# EAGLE design mini-MIDI-hub (EAGLE 6.6.0)
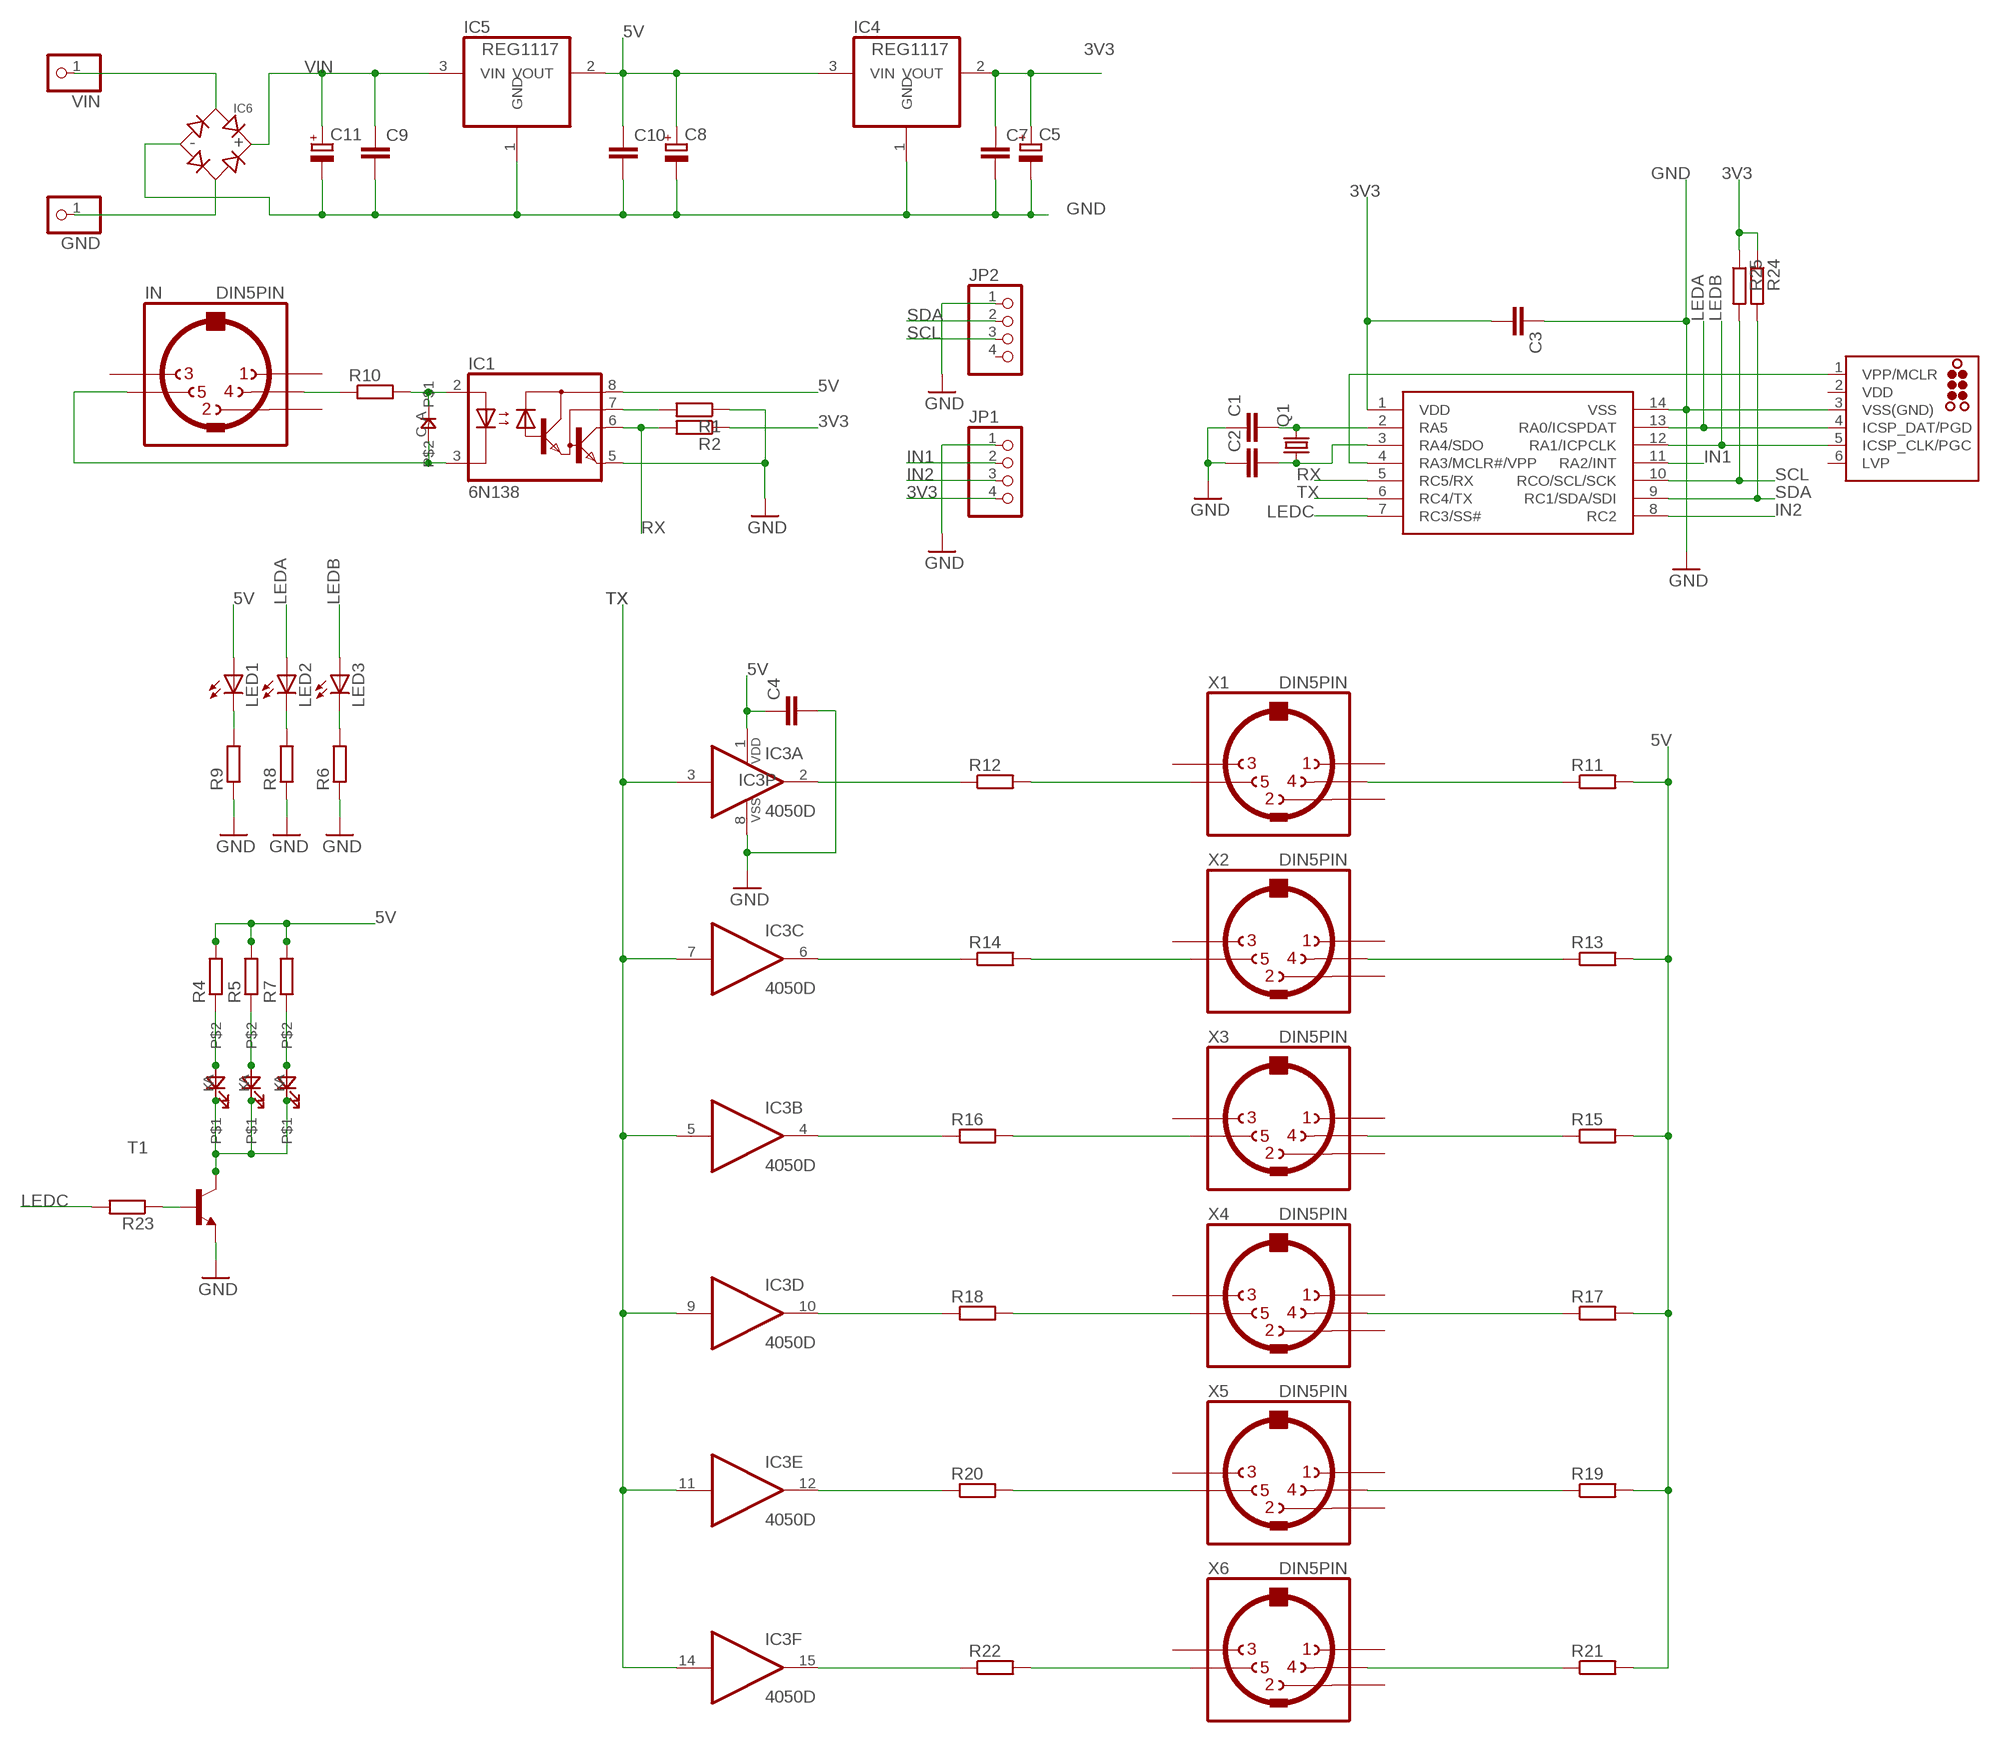
[diagram p0: schematic, sheet 1]

## Parts
C1  C-EUC0805  [C0805]
C2  C-EUC0805  [C0805]
C3  C-EUC0805  [C0805]
C4  C-EUC0805  [C0805]
C5  CPOL-EUE2-4  [E2-4]
C7  C-EUC0805  [C0805]
C8  CPOL-EUE2-4  [E2-4]
C9  C-EUC0805  [C0805]
C10  C-EUC0805  [C0805]
C11  CPOL-EUE2-4  [E2-4]
D1  0805DIODE  [0805DIODE]
GND  PINHD-1X1  [1X01]
IC1  6N138  [DIL08]
IC2  PIC16F1825SO14  [SO14]
IC3  4050D  [SO16]
IC4  REG1117  [SOT223]
IC5  REG1117  [SOT223]
IC6  BRIDGERECTIFIER  [SOIC-4]
ICSP  TC2030-MCP-NL  [TC2030-MCP-NL]
IN  DIN5PIN  [EDGEDIN]
JP1  PINHD-1X4  [1X04]
JP2  PINHD-1X4  [1X04]
LED1  LED3MM  [LED3MM]
LED2  LED3MM  [LED3MM]
LED3  LED3MM  [LED3MM]
Q1  CRYSTALHC49S  [HC49/S]
R1  R-EU_R0805  [R0805]
R2  R-EU_R0805  [R0805]
R4  R-EU_R0805  [R0805]
R5  R-EU_R0805  [R0805]
R6  R-EU_R0805  [R0805]
R7  R-EU_R0805  [R0805]
R8  R-EU_R0805  [R0805]
R9  R-EU_R0805  [R0805]
R10  R-EU_R0805  [R0805]
R11  R-EU_R0805  [R0805]
R12  R-EU_R0805  [R0805]
R13  R-EU_R0805  [R0805]
R14  R-EU_R0805  [R0805]
R15  R-EU_R0805  [R0805]
R16  R-EU_R0805  [R0805]
R17  R-EU_R0805  [R0805]
R18  R-EU_R0805  [R0805]
R19  R-EU_R0805  [R0805]
R20  R-EU_R0805  [R0805]
R21  R-EU_R0805  [R0805]
R22  R-EU_R0805  [R0805]
R23  R-EU_R0805  [R0805]
R24  R-EU_R0805  [R0805]
R25  R-EU_R0805  [R0805]
T1  MMBT3904LT1-NPN-SOT23-BEC  [SOT23-BEC]
U$2  LED5MM_EDGE  [LED5MM_EDGE]
U$3  LED5MM_EDGE  [LED5MM_EDGE]
U$4  LED5MM_EDGE  [LED5MM_EDGE]
VIN  PINHD-1X1  [1X01]
X1  DIN5PIN  [EDGEDIN]
X2  DIN5PIN  [EDGEDIN]
X3  DIN5PIN  [EDGEDIN]
X4  DIN5PIN  [EDGEDIN]
X5  DIN5PIN  [EDGEDIN]
X6  DIN5PIN  [EDGEDIN]

## Nets
3V3: C3.2 C5.+ C7.1 IC2.1(VDD) IC4.2(VOUT) JP1.4 R2.1 R24.1 R25.1
5V: C4.1 C8.+ C10.1 IC1.8(VCC) IC3.1(P:VDD) IC4.3(VIN) IC5.2(VOUT) LED1.A R4.2 R5.2 R7.2 R11.2 R13.2 R15.2 R17.2 R19.2 R21.2
GND: C1.1 C2.1 C3.1 C4.2 C5.- C7.2 C8.- C9.2 C10.2 C11.- IC1.5(GND) IC2.14(VSS) IC3.8(P:VSS) IC4.1(GND) IC5.1(GND) IC6.- ICSP.3(VSS(GND)) JP1.1 JP2.1 R1.1 R6.1 R8.1 R9.1 T1.E
IN1: IC2.11(RA2/INT) JP1.2
IN2: IC2.8(RC2) JP1.3
LEDA: IC2.13(RA0/ICSPDAT) ICSP.4(ICSP_DAT/PGD) LED2.A
LEDB: IC2.12(RA1/ICPCLK) ICSP.5(ICSP_CLK/PGC) LED3.A
LEDC: IC2.7(RC3/SS#) R23.2
N$1: R12.2 X1.5
N$2: R14.2 X2.5
N$3: R16.2 X3.5
N$4: R18.2 X4.5
N$5: R20.2 X5.5
N$6: R22.2 X6.5
N$7: IC3.15(F:O) R22.1
N$8: IC3.4(B:O) R16.1
N$9: IC3.12(E:O) R20.1
N$10: IC3.10(D:O) R18.1
N$11: IC3.6(C:O) R14.1
N$12: IC3.2(A:O) R12.1
N$13: LED2.K(C) R8.2
N$14: R11.1 X1.4
N$15: R13.1 X2.4
N$16: R15.1 X3.4
N$17: R17.1 X4.4
N$18: R19.1 X5.4
N$19: R21.1 X6.4
N$20: IN.4 R10.1
N$21: D1.A IC1.2(A) R10.2
N$22: IC1.7(VB) R1.2
N$23: LED1.K(C) R9.2
N$24: D1.C IC1.3(C) IN.5
N$25: LED3.K(C) R6.2
N$26: R4.1 U$2.A
N$27: IC6.~1(AC1) VIN.1
N$28: GND.1 IC6.~2(AC2)
N$29: C1.2 IC2.2(RA5) Q1.2
N$30: C2.2 IC2.3(RA4/SDO) Q1.1
N$31: R5.1 U$3.A
N$32: R7.1 U$4.A
N$34: T1.C U$2.K U$3.K U$4.K
N$36: IC2.4(RA3/MCLR#/VPP) ICSP.1(VPP/MCLR)
N$39: R23.1 T1.B
RX: IC1.6(VO) IC2.5(RC5/RX) R2.2
SCL: IC2.10(RCO/SCL/SCK) JP2.3 R25.2
SDA: IC2.9(RC1/SDA/SDI) JP2.2 R24.2
TX: IC2.6(RC4/TX) IC3.3(A:I) IC3.5(B:I) IC3.7(C:I) IC3.9(D:I) IC3.11(E:I) IC3.14(F:I)
VIN: C9.1 C11.+ IC5.3(VIN) IC6.+
Unconnected: ICSP.6(LVP) IN.1 IN.2 IN.3 JP2.4 X1.1 X1.2 X1.3 X2.1 X2.2 X2.3 X3.1 X3.2 X3.3 X4.1 X4.2 X4.3 X5.1 X5.2 X5.3 X6.1 X6.2 X6.3

## Power pins joined to a net without a drawn wire
VDD: ICSP.2(VDD)

## Library data of the parts
C1-C4 C7 C9 C10 = rcl:C-EU: CAPACITOR, European symbol
C5 C8 C11 = rcl:CPOL-EU: POLARIZED CAPACITOR, European symbol
D1 = jasons_stuff:0805DIODE
GND VIN = pinhead:PINHD-1X1: PIN HEADER
IC1 = optocoupler:6N138: MOTOROLA OPTO COUPLER; MF: VISHAY/TELEFUNKEN; MPN: 6N138; OC_FARNELL: 9860150; OC_NEWARK: 35K5294
IC2 = jasons_stuff:PIC16F1825
IC3 = 40xx:4050: Hex non-inverting BUFFER
IC4 IC5 = burr-brown:REG1117: 800mA and 1A Low Dropout (LDO) Positive Regulator 1.8V, 2.5V, 2.85V, 3.3V, 5V, and Adj; MPN: REG1117; OC_FARNELL: 1097566; OC_NEWARK: 14P6981
IC6 = microbuilder:BRIDGERECTIFIER: Bridge Rectifier SOIC-4: Comchip B4S-G - 400V 800mA, Peak Vf 1.1V (Digikey: 641-1334-1-ND)
ICSP = tag-connect:TC2030: TAG-CONNECT ICSP Connector Manufacturer: Tag-Connect <http://www.tag-connect.com> Cable for easy In-Circuit Serial Programming. Designed for Microchip ICD2, suitable for many others. Two variants - one "with legs" (for hands-free fit on PCB) and another "without legs" for quick programming. PAD Description 1 MCLR/Vpp 2 Vdd 3 GND 4 PGD (ISPDAT) 5 PGC (ISPCLK) 6 nc (used for LVP) ©2009 ROFA.cz - modified and updated by Robert Darlington ‹rdarlington@gmail.com›
IN X1-X6 = jason_eagle6:DIN5PIN: Female CONNECTOR 5 pins 90 deg. with shield, horizontal (DIN 41524)
JP1 JP2 = pinhead:PINHD-1X4: PIN HEADER
LED1-LED3 = led:LED: LED OSRAM: - CHIPLED LG R971, LG N971, LY N971, LG Q971, LY Q971, LO R971, LY R971 LH N974, LH R974 LS Q976, LO Q976, LY Q976 LO Q996 - Hyper CHIPLED LW Q18S LB Q993, LB Q99A, LB R99A - SideLED LS A670, LO A670, LY A670, LG A670, LP A670 LB A673, LV A673, LT A673, LW A673 LH A674 LY A675 LS A676, LA A676, LO A676, LY A676, LW A676 LS A679, LY A679, LG A679 - Hyper Micro SIDELED® LS Y876, LA Y876, LO Y876, LY Y876 LT Y87S - SmartLED LW L88C, LW L88S LB L89C, LB L89S, LG L890 LS L89K, LO L89K, LY L89K LS L896, LA L896, LO L896, LY L896 - TOPLED LS T670, LO T670, LY T670, LG T670, LP T670 LSG T670, LSP T670, LSY T670, LOP T670, LYG T670 LG T671, LOG T671, LSG T671 LB T673, LV T673, LT T673, LW T673 LH T674 LS T676, LA T676, LO T676, LY T676, LB T676, LH T676, LSB T676, LW T676 LB T67C, LV T67C, LT T67C, LS T67K, LO T67K, LY T67K, LW E67C LS E67B, LA E67B, LO E67B, LY E67B, LB E67C, LV E67C, LT E67C LW T67C LS T679, LY T679, LG T679 LS T770, LO T770, LY T770, LG T770, LP T770 LB T773, LV T773, LT T773, LW T773 LH T774 LS E675, LA E675, LY E675, LS T675 LS T776, LA T776, LO T776, LY T776, LB T776 LHGB T686 LT T68C, LB T68C - Hyper Mini TOPLED® LB M676 - Mini TOPLED Santana® LG M470 LS M47K, LO M47K, LY M47K Source: http://www.osram.convergy.de LUXEON: - LUMILED® LXK2-PW12-R00, LXK2-PW12-S00, LXK2-PW14-U00, LXK2-PW14-V00 LXK2-PM12-R00, LXK2-PM12-S00, LXK2-PM14-U00 LXK2-PE12-Q00, LXK2-PE12-R00, LXK2-PE12-S00, LXK2-PE14-T00, LXK2-PE14-U00 LXK2-PB12-K00, LXK2-PB12-L00, LXK2-PB12-M00, LXK2-PB14-N00, LXK2-PB14-P00, LXK2-PB14-Q00 LXK2-PR12-L00, LXK2-PR12-M00, LXK2-PR14-Q00, LXK2-PR14-R00 LXK2-PD12-Q00, LXK2-PD12-R00, LXK2-PD12-S00 LXK2-PH12-R00, LXK2-PH12-S00 LXK2-PL12-P00, LXK2-PL12-Q00, LXK2-PL12-R00 Source: www.luxeon.com KINGBRIGHT: KA-3528ASYC Source: www.kingbright.com
Q1 = crystal:CRYSTAL: CRYSTAL; OC_FARNELL: 1667008; OC_NEWARK: unknown
R1 R2 R4-R25 = rcl:R-EU_: RESISTOR, European symbol
T1 = transistor:*-NPN-: NPN Transistror BF959 corrected 2008.03.06
U$2-U$4 = jason_eagle6:LED5MM_EDGE

## Board
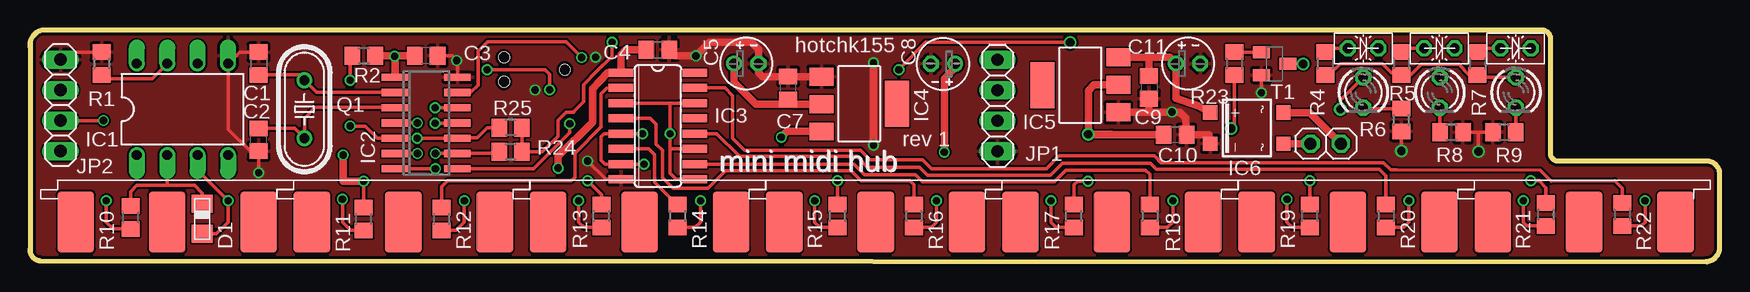
[diagram p1: board, top side]
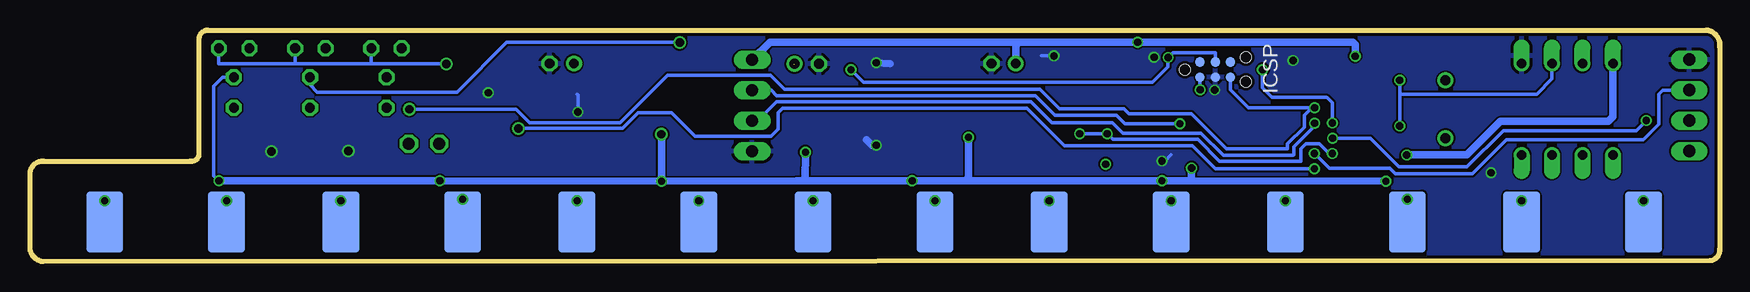
[diagram p2: board, bottom side, seen from below]

Size 140.85 x 19.3 mm. Coordinates in mm from the lower left corner, seen from the top.
Outline: 139.71,8.38 127.52,8.38 arc-90 126.75,8.89 126.75,18.54 arc90 126.02,19.3 1.1,19.3 arc90 0.01,17.91 0.01,1.07 arc90 0.8,0.08 139.71,0 arc90 140.85,1.27 140.85,7.37 arc90 139.71,8.38
Copper layers (1*16): Top 0.035mm / dielectric 1.5mm / Bottom 0.035mm
Design rules "ITEADstudio_DRC": minimum track width 6mil, minimum drill 12mil, track to track 6mil, track to pad 6mil, pad to pad 6mil, via to via 6mil, smd to smd 0mil, copper to edge 10mil, drill to drill 10mil, minimum pad ring 10mil, minimum via ring 6mil, stop-mask expansion 2mil, vias tented up to drill 100mil, thermal gap 10mil

### Footprints (pad centres in the part's own frame; a part is rotated, then mirrored left to right if it is on the bottom)
C0805 = smd 1.3 x 1.5: 1 -0.95,0; 2 0.95,0
E2-4 = drill 0.813 pad 1.27: + -1.016,0 | drill 0.813 pad 1.27 octagon: - 1.016,0
0805DIODE = smd 1.524 x 1.778: A -1.262,-0.005; C 1.238,-0.005
1X01 = drill 1.016 octagon: 1 0,0
DIL08 = drill 0.813 offset: 1 -3.81,-3.81; 2 -1.27,-3.81; 3 1.27,-3.81; 4 3.81,-3.81; 5 3.81,3.81; 6 1.27,3.81; 7 -1.27,3.81; 8 -3.81,3.81
SO14 = smd 0.6 x 2.2: 1 -3.81,-2.6; 2 -2.54,-2.6; 3 -1.27,-2.6; 4 0,-2.6; 5 1.27,-2.6; 6 2.54,-2.6; 7 3.81,-2.6; 8 3.81,2.6; 9 2.54,2.6; 10 1.27,2.6; 11 0,2.6; 12 -1.27,2.6; 13 -2.54,2.6; 14 -3.81,2.6
SO16 = smd 0.66 x 2.032: 1 -4.445,-3.073; 2 -3.175,-3.073; 3 -1.905,-3.073; 4 -0.635,-3.073; 5 0.635,-3.073; 6 1.905,-3.073; 7 3.175,-3.073; 8 4.445,-3.073; 9 4.445,3.073; 10 3.175,3.073; 11 1.905,3.073; 12 0.635,3.073; 13 -0.635,3.073; 14 -1.905,3.073; 15 -3.175,3.073; 16 -4.445,3.073
SOT223 = smd 1.499 x 2.007: 1 -2.261,-3.15; 2 0.025,-3.15; 3 2.311,-3.15 | smd 3.81 x 2.007: 4 0,3.15
SOIC-4 = smd 1.2 x 1.2: + 1.3,3.05; - -1.3,3.05; ~1 -1.3,-3.05; ~2 1.3,-3.05
TC2030-MCP-NL = smd 0.787 x 0.787: 1 1.27,-0.635; 2 1.27,0.635; 3 2.54,-0.635; 4 2.54,0.635; 5 3.81,-0.635; 6 3.81,0.635 | hole 0.889: 0,0; 5.08,-1.016; 5.08,1.016
EDGEDIN = smd 3.048 x 5.08: 1 -7.62,-10.16; 2 0,-10.16; 3 7.62,-10.16 | smd 3.048 x 5.08 bottom: 4 -5.08,-10.16; 5 5.08,-10.16
1X04 = drill 1.016 long: 1 -3.81,0; 2 -1.27,0; 3 1.27,0; 4 3.81,0
LED3MM = drill 0.813 octagon: A -1.27,0; K 1.27,0
HC49/S = drill 0.813: 1 -2.413,0; 2 2.413,0
R0805 = smd 1.3 x 1.5: 1 -0.95,0; 2 0.95,0
SOT23-BEC = smd 1 x 1.4: B -0.95,-1.1; C 0,1.1; E 0.95,-1.1
LED5MM_EDGE = drill 0.813 octagon: A -1.27,0; K 1.27,0

### Placement (x,y rotation side)
C1  19.06,16.51 270 top
C2  19.06,10.16 90 top
C3  33.03,17.14 180 top
C4  52.33,17.65 0 top
C5  59.7,16.51 0 top
C7  63.2,14.48 90 top
C8  76.11,16.48 180 top
C9  93.28,14.53 270 top
C10  95.46,10.59 0 top
C11  96.53,16.51 0 top
D1  14.36,3.56 270 top
GND  109.28,9.83 0 top
IC1  12.71,12.7 0 top
IC2  33.03,11.56 270 top
IC3  52.33,11.3 270 top
IC4  69.12,13.16 270 top
IC5  87.56,14.71 90 top
IC6  101.43,11.13 90 top
ICSP  44.59,16 0 bottom
IN  11.44,13.46 0 top
JP1  80.65,13 90 top
JP2  2.55,13.03 270 top
LED1  123.86,14.1 270 top
LED2  117.51,14.1 270 top
LED3  111.13,14.1 270 top
Q1  22.87,12.7 90 top
R1  5.98,16.51 270 top
R2  27.82,17.14 180 top
R4  107.96,16.51 270 top
R5  114.31,16.51 270 top
R6  114.31,11.81 90 top
R7  120.66,16.51 270 top
R8  118.5,10.77 180 top
R9  122.89,10.79 0 top
R10  8.39,3.68 90 top
R11  27.82,3.56 90 top
R12  34.3,3.56 270 top
R13  47.63,3.81 90 top
R14  53.98,3.81 270 top
R15  67.32,3.81 90 top
R16  73.67,3.81 270 top
R17  87,3.81 90 top
R18  93.35,3.81 270 top
R19  106.69,3.81 90 top
R20  113.04,3.81 270 top
R21  126.37,3.94 90 top
R22  132.72,3.94 270 top
R23  100.39,16.51 270 top
R24  40.06,9.14 180 top
R25  40.06,11.18 180 top
T1  103.74,16.48 270 top
U$2  111.13,17.78 0 top
U$3  117.48,17.78 0 top
U$4  123.83,17.78 0 top
VIN  106.74,9.83 0 top
X1  31.12,13.46 0 top
X2  50.81,13.46 0 top
X3  70.49,13.46 0 top
X4  90.18,13.46 0 top
X5  109.86,13.46 0 top
X6  129.55,13.46 0 top

### Tracks (layer width: path | path; a pad name or v marks a point on that pad's centre or on a via)
3V3  (via drill 0.6)
  Top 0.305: 63.6,13.13 C7.1 | R25.1 41,11.17 41.01,11.16 R24.1 42.71,9.14 44.03,10.46 44.03,11.79 44.69,12.45 45.32,12.45 45.32,12.47 46.16,13.31 46.16,14.76 47.19,15.8 | v48.52,18.29 48.52,17.14 47.19,15.8 | 47.19,15.8 47.89,16.51
  Top 0.61: R2.1 30.49,17.14 | 30.49,17.14 C3.2 30.41,17.14 v30.39,17.12 | IC2.1 30.43,17.09 30.49,17.14 | C5.+ 58.68,14.96 60.51,13.13 63.6,13.13 IC4.2
  Bottom 0.61: v30.39,17.12 30.39,18.09 30.59,18.29 v48.52,18.29 58.43,18.29 | 58.43,18.29 79.18,18.29 JP1.4 | C5.+ 58.68,18.03 58.43,18.29
5V  (via drill 0.6, 0.7)  (1 unrouted)
  Top 0.305: 49.16,15.85 IC3.1 | R13.2 47.63,5.59 v46.49,6.73 | R15.2 v67.32,6.73 | R19.2 v106.69,6.73 | R11.2 v27.82,6.71 | v88.2,6.71 87.33,6.71 87.03,6.4 87.03,4.79 R17.2 | R21.2 126.37,6.17 125.81,6.73 v125.1,6.73 125.15,6.78 | R4.2 108.28,15.56 109.23,16.51 112.71,16.51 113.47,15.75 114.12,15.75 R5.2 115.09,15.56 115.96,16.43 119.08,16.43 119.95,15.57 R7.2 120.85,15.37 LED1.A
  Top 0.61: v26.09,8.89 26.09,6.71 v27.82,6.71 | IC4.3 63.1,10.85 v62.62,10.36 | C4.1 49.67,17.65 49.26,17.25 IC3.1 48.14,15.75 46.9,14.4 46.9,11.63 44.03,8.76 v44.03,7.8 | C10.1 90.18,10.59 | 90.18,10.59 88.25,10.59 v88.22,10.62 | IC5.2 88.71,14.73 88.22,14.25 v88.22,10.62 | 77.15,16.46 77.15,16.18 76.21,15.24 v76.21,9.12 | v88.22,10.62 90.15,10.62 90.18,10.59
  Bottom 0.305: v125.1,6.73 125.54,7.16 125.54,14.61 124.77,15.37 LED1.A
  Bottom 0.61: v88.2,6.71 v106.69,6.73 123.86,6.73 | v88.2,6.71 76.97,6.73 76.21,6.73 | 76.21,6.73 v67.32,6.73 62.87,6.73 | 62.87,6.73 v46.49,6.73 43.93,6.73 | 43.93,6.73 v27.82,6.71 | IC1.8 8.9,12.06 9.28,11.68 18.3,11.68 21.09,8.89 v26.09,8.89 | v62.62,10.36 62.62,6.99 62.87,6.73 | 123.86,6.73 v125.1,6.73 | 123.83,6.76 123.86,6.73 | v88.2,6.71 88.2,10.59 v88.22,10.62 | v44.03,7.8 44.03,6.83 43.93,6.73 | v76.21,9.12 76.23,6.76 76.21,6.73
GND  (via drill 0.6, 0.7)
  Top 0.305: C1.1 17.47,17.46 IC1.5 16.52,11.05 18.42,9.14 18.99,9.14 C2.1 v19.06,7.42 | IC2.14 35.63,16.7 v35.57,16.76 35.19,17.14 C3.1 | IC3.8 48.01,6.86 v46.49,8.38 | R1.1 3.17,17.46 JP2.1 | 95.84,12.45 95.21,12.45 v95.18,12.47 | T1.E v102.64,14.08 v102.65,14.07 | 120.73,10.77 121.92,10.77 R9.1 | R6.1 v114.31,9.22 | R8.1 120.73,10.77 | 120.73,10.77 v120.73,9.2
  Top 0.61: IC4.1 63.21,15.42 | 63.21,15.42 C7.2 | 63.21,15.42 61.04,15.42 60.71,15.75 C5.- 60.71,17.7 60.13,18.29 56.65,18.29 v55.51,17.14 53.79,17.14 C4.2 | v70.32,16.59 v70.32,9.7 | IC5.1 93.33,12.45 | 93.33,12.45 95.84,12.45 96.35,11.94 96.35,10.65 C10.2 98.27,10.59 IC6.- | C9.2 93.28,12.5 93.33,12.45
  Bottom 0.305: v19.06,7.42 18.93,7.49 19.06,7.62 | v35.57,16.76 35.57,16.51 | v46.49,8.38 46.24,8.38 45.73,8.89 | v55.51,17.14 56.52,17.14 | v95.18,12.47 95.18,13.89 95.26,13.97
  Bottom 0.61: 69.15,16.48 v70.32,16.59 | v70.32,9.7 70.67,9.7 71.13,10.16
  other vias: 42.1,14.3 47.15,17.04
  pour Bottom: -1.26,24.13 -1.26,-2.54 144.79,-2.54 144.79,24.13
  pour Top: -4.56,21.08 -4.56,-4.06 146.06,-4.06 146.06,26.16 -4.56,26.16
IN1  (via drill 0.6)
  Top 0.305: IC2.11 35.6,11.53 v33.77,11.53
  Bottom 0.305: JP1.2 80.22,11.73 78.62,13.34 57.41,13.34 55.66,11.58 50.61,11.58 49.74,10.72 43.24,10.72 41.39,8.87 35.57,8.87 35.52,8.91 35.52,9.58 33.77,11.33 v33.77,11.53
IN2  (via drill 0.6)
  Top 0.305: IC2.8 41.99,7.75 44.99,10.74 v44.99,11.48
  Bottom 0.305: JP1.3 79.05,14.28 78.62,13.84 57.06,13.84 55.43,12.22 50.3,12.22 49.56,11.48 v44.99,11.48
LEDA  (via drill 0.6, 0.7)
  Top 0.305: v72.42,16 72.42,16.03 74.66,18.26 v86.7,18.26 | IC2.13 36.74,14.1 37.35,14.71 37.35,17.53 38.13,18.31 44.69,18.31 v45.98,17.02
  Bottom 0.305: v72.42,16 71.36,14.94 47.3,14.94 45.98,16.26 v45.98,17.02 45.6,17.42 42.05,17.42 ICSP.4 41.92,16.64 | v86.7,18.26 101.13,18.26 105.27,14.12 116.9,14.12 117.51,14.73 LED2.A
LEDB  (via drill 0.6, 0.7)
  Top 0.305: v109.23,12.7 109.23,13.46 LED3.A | IC2.12 v33.77,12.83
  Bottom 0.305: v109.23,12.7 100.34,12.7 99.2,11.56 91.68,11.56 87.69,15.54 79.13,15.54 77.96,14.38 56.68,14.38 55.02,12.72 49.67,12.72 49.26,12.32 44.03,12.32 41.13,9.42 36.05,9.42 36.03,9.45 36.03,9.8 34.63,11.2 34.63,12.19 33.99,12.83 v33.77,12.83 39.3,12.83 40.8,14.33 40.8,15.34 ICSP.5
LEDC  (via drill 0.6, 0.7)
  Top 0.305: IC2.7 v33.79,7.75 | R23.2 100.39,11.35 v100.14,11.1
  Bottom 0.305: v33.79,7.75 42.02,7.75 43.94,9.66 54.63,9.66 57.74,12.78 78.11,12.78 78.49,12.39 78.49,11.02 79.03,10.49 79.05,10.49 79.08,10.46 85.4,10.46 87.36,12.42 90.15,12.42 91.47,11.1 v100.14,11.1
N$1  (via drill 0.6)
  Top 0.305: R12.2 35.51,2.61 X1.5 v36.2,5.08
  Bottom 0.305: v36.2,5.08 X1.5
N$2  (via drill 0.6)
  Top 0.305: R14.2 55.45,2.86 X2.5 v55.89,5.08
  Bottom 0.305: v55.89,5.08 X2.5
N$3  (via drill 0.6)
  Top 0.305: R16.2 75.13,2.86 X3.5 v75.57,5.08
  Bottom 0.305: v75.57,5.08 X3.5
N$4  (via drill 0.6)
  Top 0.305: R18.2 94.82,2.86 X4.5 v95.26,5.08
  Bottom 0.305: v95.26,5.08 X4.5
N$5  (via drill 0.6)
  Top 0.305: R20.2 114.5,2.86 X5.5 v114.94,5.08
  Bottom 0.305: v114.94,5.08 X5.5
N$6  (via drill 0.6)
  Top 0.305: R22.2 134.31,2.99 X6.5 v134.63,5.08
  Bottom 0.305: 134.63,3.81 v134.63,5.08 X6.5
N$7
  Top 0.305: R22.1 132.72,6.1 132.09,6.73 126.81,6.71 125.89,7.62 113.9,7.64 113.42,7.64 112.81,8.26 94.27,8.26 93.71,8.81 85.78,8.81 84.72,7.75 75.14,7.75 74.38,8.51 70.01,8.51 69.22,9.3 59.55,9.3 58.56,10.29 58.56,13.84 57.92,14.48 IC3.15
N$8
  Top 0.305: IC3.4 51.7,11.94 52.21,11.43 52.21,9.78 52.71,9.27 52.71,6.99 53.6,6.1 56.52,6.1 58,7.57 68.44,7.57 69.27,6.73 73.36,6.73 73.67,6.43 R16.1
N$9
  Top 0.305: R20.1 113.04,7.14 112.48,7.7 93.89,7.7 93.38,8.2 86.06,8.2 85.05,7.19 74.81,7.19 74.13,7.87 69.81,7.87 68.92,8.76 59.14,8.76 57.23,10.67 IC3.12
N$10
  Top 0.305: IC3.10 68.69,8.13 69.58,7.24 73.8,7.24 74.38,6.66 85.4,6.66 86.37,7.62 93,7.62 93.35,7.26 R18.1
N$11
  Top 0.305: IC3.6 51.57,9.4 52.08,8.89 52.08,6.6 53.92,4.76 R14.1
N$12
  Top 0.305: R12.1 34.3,6.22 34.81,6.73 45.12,6.73 45.42,7.04 45.42,9.04 47.61,11.23 47.61,13.99 48.07,14.45 IC3.2
N$13
  Top 0.305: LED2.K 117.51,10.81 R8.2
N$14  (via drill 0.6)
  Top 0.305: R11.1 26.74,2.61 X1.4 v26.04,5.21
  Bottom 0.305: v26.04,5.21 X1.4
N$15  (via drill 0.6)
  Top 0.305: R13.1 46.17,2.86 X2.4 v45.73,5.08
  Bottom 0.305: v45.73,5.08 X2.4
N$16  (via drill 0.6)
  Top 0.305: R15.1 65.86,2.86 X3.4 v65.41,5.08
  Bottom 0.305: v65.41,5.08 X3.4
N$17  (via drill 0.6)
  Top 0.305: R17.1 85.54,2.86 X4.4 v85.1,5.08
  Bottom 0.305: v85.1,5.08 X4.4
N$18  (via drill 0.6)
  Top 0.305: R19.1 105.23,2.86 X5.4 v104.78,5.21
  Bottom 0.305: v104.78,5.21 X5.4
N$19  (via drill 0.6)
  Top 0.305: R21.1 124.78,2.99 X6.4 v124.47,5.08
  Bottom 0.305: v124.47,5.08 X6.4
N$20  (via drill 0.6)
  Top 0.305: R10.1 6.93,2.73 IN.4 v6.36,5.08
  Bottom 0.305: v6.36,5.08 IN.4
N$21
  Top 0.305: R10.2 8.39,5.84 8.9,6.35 11.44,6.35 | 11.44,6.35 13.72,6.35 14.35,5.72 D1.A | IC1.2 11.44,6.35
N$22
  Top 0.305: IC1.7 10.17,15.24 6.3,15.24 R1.2
N$23
  Top 0.305: LED1.K 123.86,10.81 R9.2
N$24  (via drill 0.6)
  Top 0.305: D1.C 15.53,2.32 IN.5 v16.52,5.08 13.98,7.62 IC1.3
  Bottom 0.305: v16.52,5.08 IN.5
N$25
  Top 0.305: R6.2 111.2,12.76 LED3.K
N$26
  Top 0.305: U$2.A 107.96,17.78 R4.1
N$27
  Top 0.61: IC6.~1 VIN.1
N$28
  Top 0.61: IC6.~2 106.68,12.43 GND.1
N$29
  Top 0.305: C1.2 22.42,15.56 Q1.2 23.88,14.1 IC2.2
N$30
  Top 0.305: C2.2 22.05,11.11 Q1.1 22.89,10.31 22.89,11.96 23.78,12.85 30.4,12.85 IC2.3
N$31
  Top 0.305: U$3.A 114.31,17.78 R5.1
N$32
  Top 0.305: U$4.A 120.66,17.78 R7.1
N$34  (via drill 0.7)
  Top 0.305: T1.C v106.13,16.48
  Bottom 0.305: v106.13,16.48 112.4,16.48 | 112.4,16.48 116.85,16.48 | 116.85,16.48 118.73,16.48 | 118.73,16.48 125.1,16.48 U$4.K | 116.85,16.51 116.85,16.48 | U$3.K 118.73,17.78 118.73,16.48 | U$2.K 112.4,16.48
N$36  (via drill 0.6)
  Top 0.305: IC2.4 v32.29,11.56 | v38.11,16 42.93,16 43.32,15.62 v43.32,14.33
  Bottom 0.305: v32.29,11.56 32.29,13.26 32.7,13.66 32.77,13.72 37.35,13.72 38.11,14.48 v38.11,16 | v43.32,14.33 ICSP.1
N$39
  Top 0.305: R23.1 102.62,17.46 T1.B
RX  (via drill 0.6)
  Top 0.305: v26.68,15.11 26.68,16.95 R2.2 | IC2.5 28.96,10.29 27.95,11.3 v26.68,11.3
  Bottom 0.305: IC1.6 13.98,15.24 15.25,13.97 26.68,13.97 | v26.68,15.11 26.68,13.97 | 26.68,13.97 v26.68,11.3
SCL  (via drill 0.6)
  Top 0.305: JP2.3 v6.13,11.76 | v32.27,10.29 IC2.10 35.68,10.34 37.27,10.34 38.11,11.18 R25.2
  Bottom 0.305: v6.13,11.76 6.97,10.92 18.04,10.92 21.07,7.9 26.75,7.9 29.14,10.29 v32.27,10.29
SDA  (via drill 0.6)
  Top 0.305: v33.79,9.02 IC2.9 38.99,9.02 R24.2
  Bottom 0.305: JP2.2 4.76,14.3 5.09,13.97 5.09,11.43 6.36,10.16 17.79,10.16 20.63,7.32 27.06,7.32 27.52,7.77 32.55,7.77 v33.79,9.02
TX  (via drill 0.6)
  Top 0.305: IC3.5 v51.06,10.67 47.86,10.67 47.61,10.41 47.61,8.46 47.94,8.13 v51.19,8.13 IC3.7 | IC3.11 53.35,9.4 | IC3.9 53.86,6.86 53.35,7.37 53.35,9.4 | 53.35,13.21 IC3.3 52.84,13.21 | 53.35,13.21 IC3.14 | 53.35,13.21 v53.35,10.67 53.35,9.4 | IC2.6 v32.29,9.02
  Bottom 0.305: v53.35,10.67 v51.06,10.67 50.58,10.19 43.52,10.19 41.69,8.36 34.93,8.36 34.93,9.42 34.5,9.83 33.38,9.83 32.57,9.02 v32.29,9.02
VIN
  Top 0.61: IC5.3 93.43,17.02 | 93.43,17.02 95,17.02 C11.+ 95.51,13.61 97.36,13.01 IC6.+ | C9.1 93.28,16.87 93.43,17.02

### Text on the board
tNames: hotchk155 | rev 1 | mini midi hub | mini midi hub